# EAGLE board untitled (EAGLE 9.6.2)
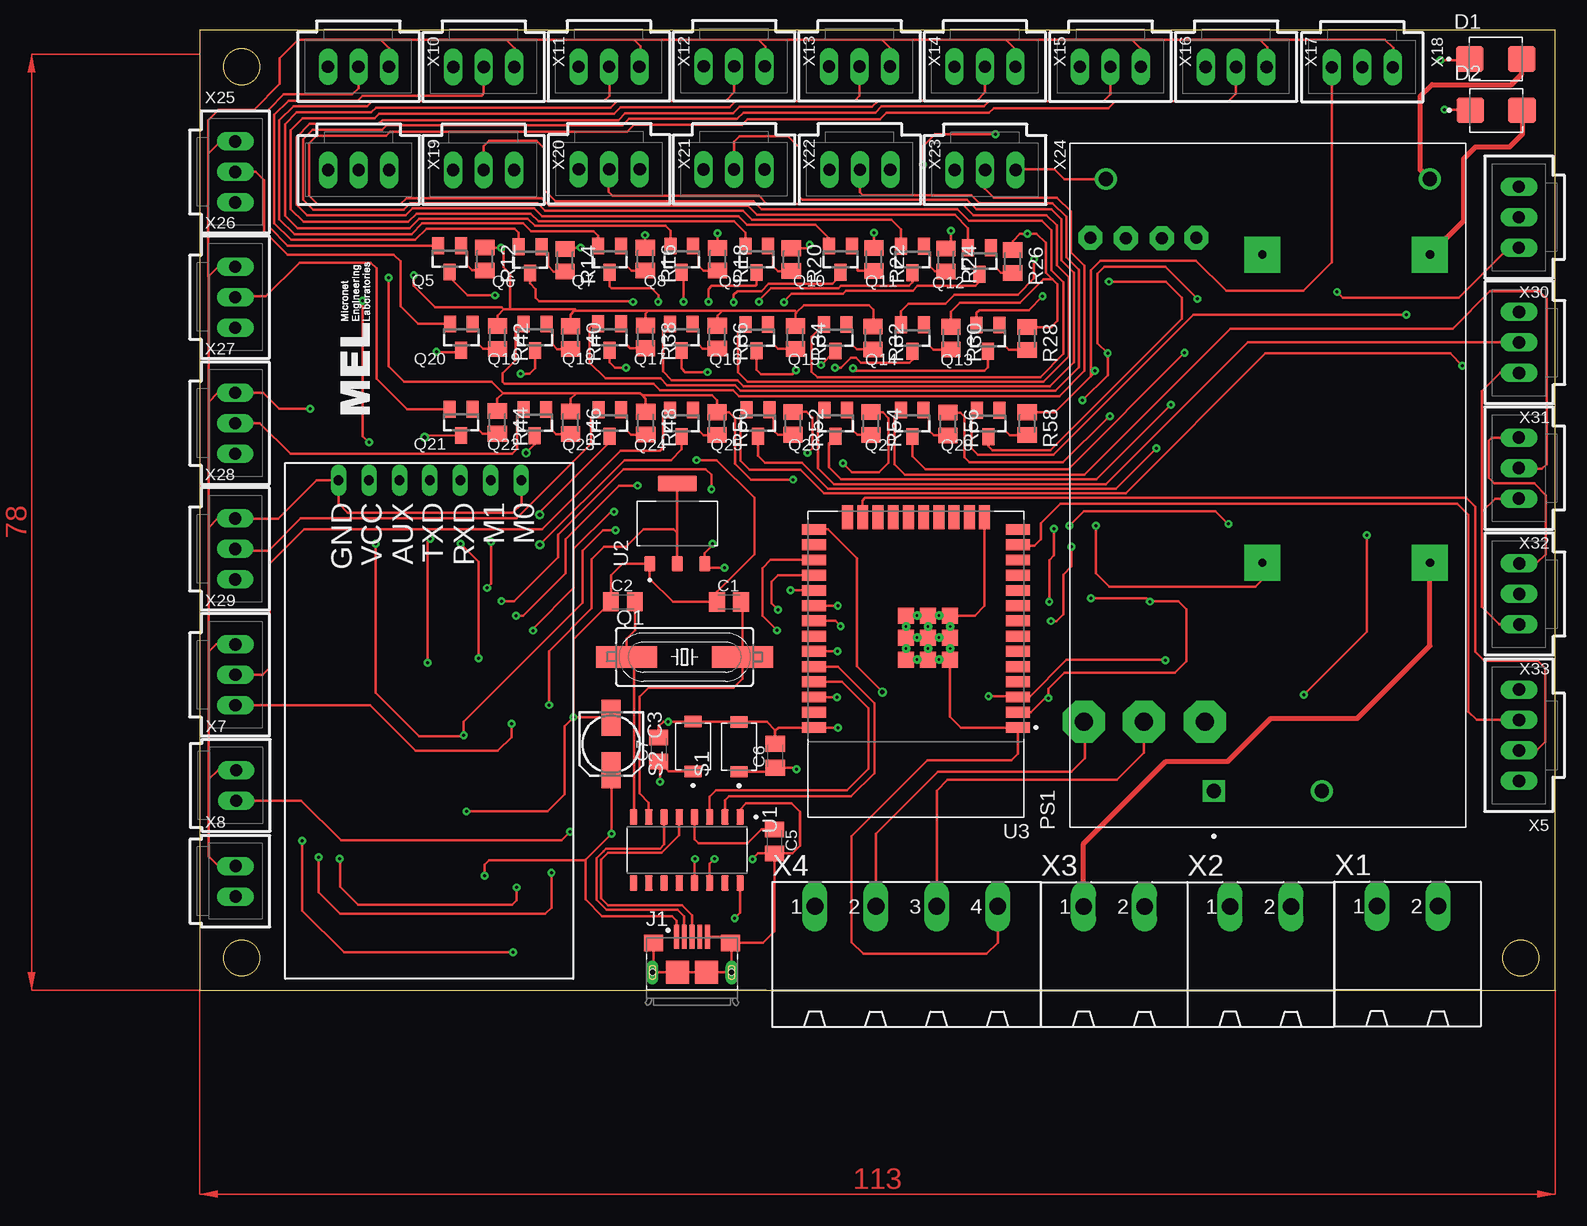
[diagram p2: board, top side]
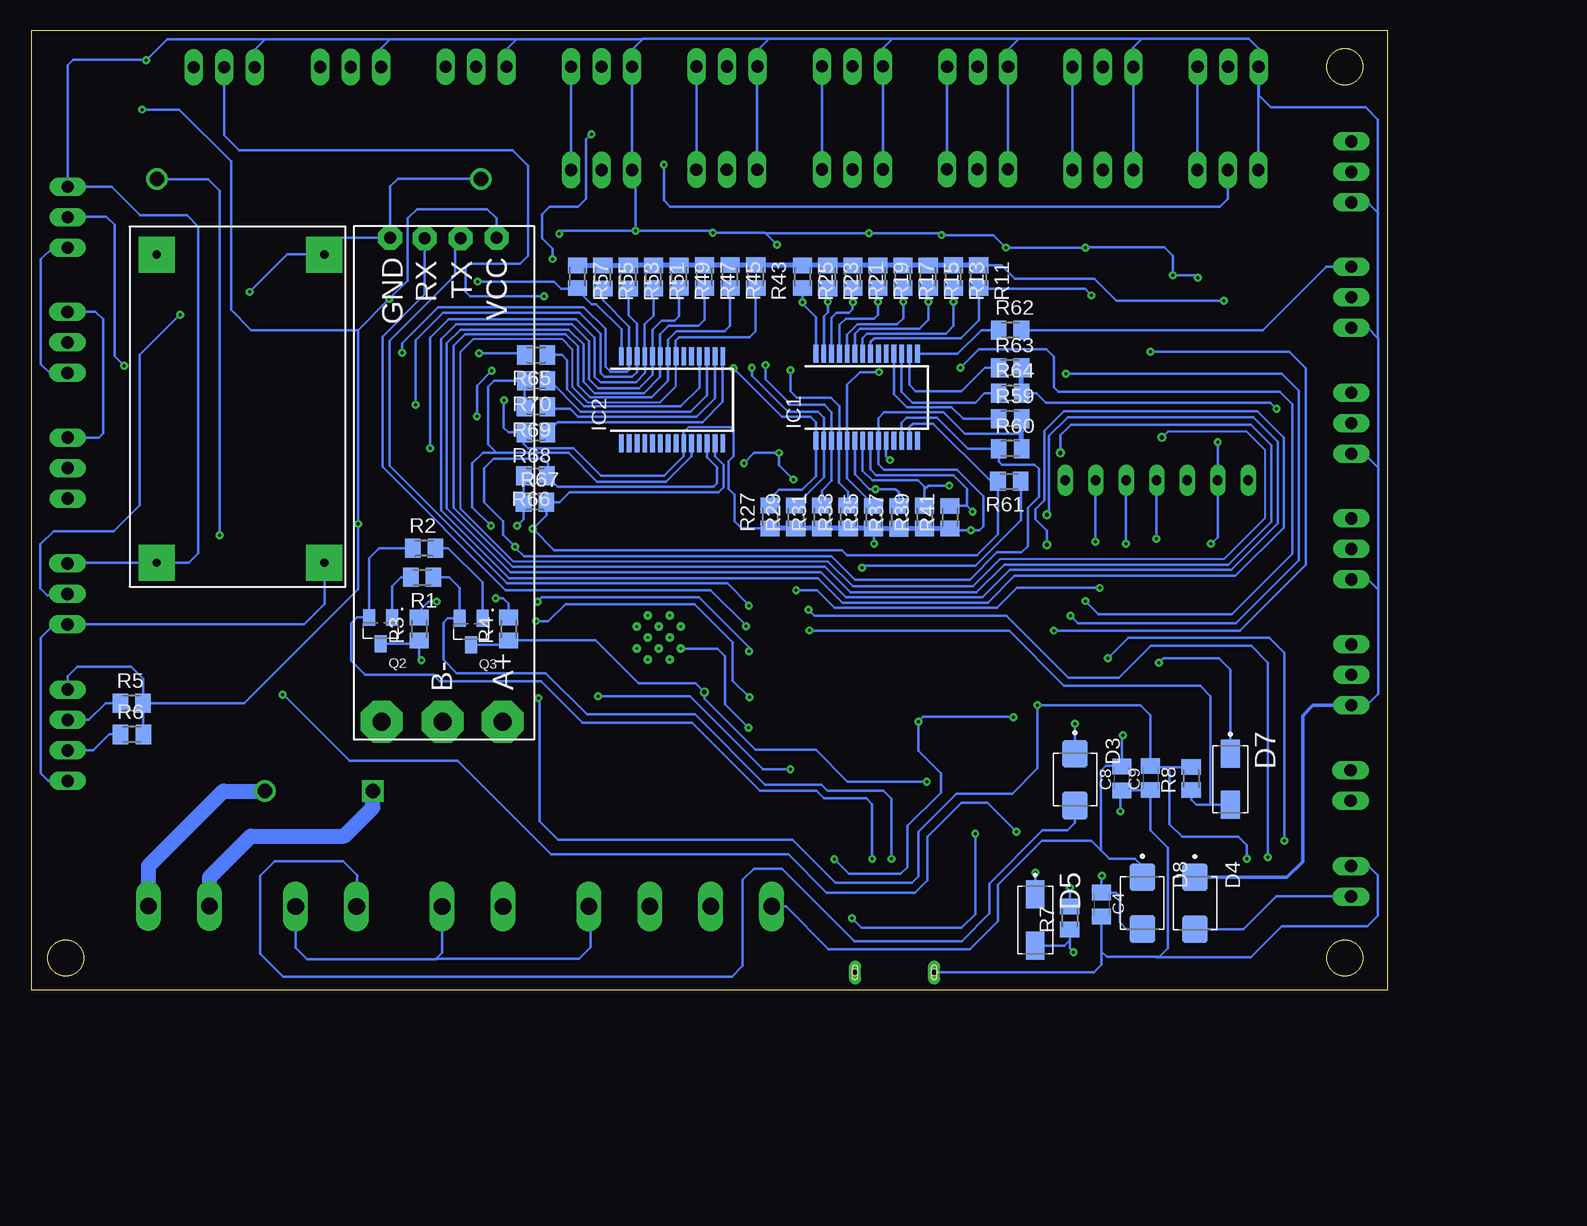
[diagram p3: board, bottom side, seen from below]

Size 113 x 80 mm. Coordinates in mm from the lower left corner, seen from the top.
Outline: 0,0 113,0 113,80 0,80 0,0
Outline: circle at 110.14,2.67 radius 1.5
Outline: circle at 3.52,2.67 radius 1.5
Outline: circle at 3.52,76.95 radius 1.5
Copper layers (1*16): Top 0.035mm / dielectric 1.5mm / Bottom 0.035mm
Design rules "default *": minimum track width 6mil, minimum drill 0.25mm, track to track 6mil, track to pad 6mil, pad to pad 6mil, via to via 6mil, smd to smd 6mil, copper to edge 40mil, drill to drill 6mil, minimum pad ring 10mil, minimum via ring 8mil, stop-mask expansion 4mil, vias tented up to drill 0mil, thermal gap 10mil

## Footprints (pad centres in the part's own frame; a part is rotated, then mirrored left to right if it is on the bottom)
C0805K = smd 1.3 x 1.6: 1 -1,0; 2 1,0
153CLV-0505 = smd 3 x 1.6: + 2.2,0; - -2.2,0
DIOM5336X265N = smd 2.29 x 2.12: A 2.16,0; C -2.16,0
DIOM5226X240N = smd 2.33 x 1.55: A 2.135,0; C -2.135,0
EBYTEE220-900T22D = drill 0.8 pad 1.27 long: AUX -4.56,-10.98; GND -4.56,-16.06; M0 -4.56,-0.82; M1 -4.56,-3.36; RXD -4.56,-5.9; TXD -4.56,-8.44; VCC -4.56,-13.52
SSOP28 = smd 0.4 x 1.5: 1 -4.225,-3.625; 2 -3.575,-3.625; 3 -2.925,-3.625; 4 -2.275,-3.625; 5 -1.625,-3.625; 6 -0.975,-3.625; 7 -0.325,-3.625; 8 0.325,-3.625; 9 0.975,-3.625; 10 1.625,-3.625; 11 2.275,-3.625; 12 2.925,-3.625; 13 3.575,-3.625; 14 4.225,-3.625; 15 4.225,3.625; 16 3.575,3.625; 17 2.925,3.625; 18 2.275,3.625; 19 1.625,3.625; 20 0.975,3.625; 21 0.325,3.625; 22 -0.325,3.625; 23 -0.975,3.625; 24 -1.625,3.625; 25 -2.275,3.625; 26 -2.925,3.625; 27 -3.575,3.625; 28 -4.225,3.625
FCI_10118193-0001LF = smd 0.4 x 2: 1 -1.3,2.975; 2 -0.65,2.975; 3 0,2.975; 4 0.65,2.975; 5 1.3,2.975 | smd 1.6 x 1.4: S1 -3.2,2.45; S2 3.2,2.45 | smd 1.9 x 1.9: S3 1.2,0; S4 -1.2,0 | drill 0.5 pad 0.9 long: S5 -3.3,0; S6 3.3,0 | hole 0.5: -3.3,0; 3.3,0
MINI560 = drill 0.7 pad 3 square: IN+ 0,-1.27; IN- 0,-15.24; OUT+ 25.67,-1.27; OUT- 25.67,-15.24
CONV_HLK-20M12 = drill 1.2 square: 1 -25.5,4.5 | drill 1.2: 2 -25.5,-4.5; 3 25.5,13.5; 4 25.5,-13.5
SM49 = smd 5.08 x 1.778: 1 -4.826,0; 2 4.826,0
SOT95P240X120-3N = smd 1 x 1.4: 1 -0.95,-1.1; 2 0.95,-1.1; 3 0,1.1
SOT23-BEC = smd 1 x 1.4: B -0.95,-1.1; C 0,1.1; E 0.95,-1.1
M0805 = smd 1.3 x 1.6: 1 -0.95,0; 2 0.95,0
SW_TL1015AF160QG = smd 0.95 x 1.4: 1 -2.075,0; 2 2.075,0
TTL-RS485 = drill 1.5 pad 3.5 octagon: A -19.7,-6; B -19.7,-1; P$7 -19.7,4.1 | drill 1 pad 2 octagon: GND 20.6,3.37; RX 20.581,0.505; TX 20.583,-2.493; VCC 20.6,-5.47
SOIC127P600X180-16N = smd 1.31 x 0.62: 1 -2.75,4.445; 2 -2.75,3.175; 3 -2.75,1.905; 4 -2.75,0.635; 5 -2.75,-0.635; 6 -2.75,-1.905; 7 -2.75,-3.175; 8 -2.75,-4.445; 9 2.75,-4.445; 10 2.75,-3.175; 11 2.75,-1.905; 12 2.75,-0.635; 13 2.75,0.635; 14 2.75,1.905; 15 2.75,3.175; 16 2.75,4.445
SOT229P700X180-4N = smd 1.31 x 0.93: 1 -3.345,2.29; 2 -3.345,0; 3 -3.345,-2.29 | smd 1.31 x 3.24: 4 3.345,0
MODULE_ESP32-WROOM-32D = smd 2 x 0.9: 1 -8.5,5.26; 2 -8.5,3.99; 3 -8.5,2.72; 4 -8.5,1.45; 5 -8.5,0.18; 6 -8.5,-1.09; 7 -8.5,-2.36; 8 -8.5,-3.63; 9 -8.5,-4.9; 10 -8.5,-6.17; 11 -8.5,-7.44; 12 -8.5,-8.71; 13 -8.5,-9.98; 14 -8.5,-11.25; 25 8.5,-11.25; 26 8.5,-9.98; 27 8.5,-8.71; 28 8.5,-7.44; 29 8.5,-6.17; 30 8.5,-4.9; 31 8.5,-3.63; 32 8.5,-2.36; 33 8.5,-1.09; 34 8.5,0.18; 35 8.5,1.45; 36 8.5,2.72; 37 8.5,3.99; 38 8.5,5.26 | smd 0.9 x 2: 15 -5.715,-12.25; 16 -4.445,-12.25; 17 -3.175,-12.25; 18 -1.905,-12.25; 19 -0.635,-12.25; 20 0.635,-12.25; 21 1.905,-12.25; 22 3.175,-12.25; 23 4.445,-12.25; 24 5.715,-12.25 | smd 1.33 x 1.33: 39_1 -2.835,-0.405; 39_2 -1,-0.405; 39_3 0.835,-0.405; 39_4 -2.835,-2.24; 39_5 -1,-2.24; 39_6 0.835,-2.24; 39_7 -2.835,-4.075; 39_8 -1,-4.075; 39_9 0.835,-4.075 | drill 0.2 pad 0.3: 39_10 -1.917,-0.405; 39_11 -0.083,-0.405; 39_12 -2.835,-1.323; 39_13 -1,-1.323; 39_14 0.835,-1.323; 39_15 -1.917,-2.24; 39_16 -0.083,-2.24; 39_17 -2.835,-3.158; 39_18 -1,-3.158; 39_19 0.835,-3.158; 39_20 -1.917,-4.075; 39_21 -0.083,-4.075
MSTBA2 = drill 1.397 long: 1 -2.54,5.08; 2 2.54,5.08
MSTBA4 = drill 1.397 long: 1 -7.62,5.08; 2 -2.54,5.08; 3 2.54,5.08; 4 7.62,5.08
70543-04 = drill 1.016 long: 1 -3.81,0; 2 -1.27,0; 3 1.27,0; 4 3.81,0
70543-02 = drill 1.016 long: 1 -1.27,0; 2 1.27,0
70543-03 = drill 1.016 long: 1 -2.54,0; 2 0,0; 3 2.54,0

## Placement (x,y rotation side)
C1  22pF  [C0805K]  44.14,32.33 0 top
C2  22pF  [C0805K]  35.29,32.34 0 top
C3  10uF/16V  [153CLV-0505]  34.31,20.5 270 top
C4  1uF  [C0805K]  23.81,7.11 270 bottom
C5  100nF  [C0805K]  47.93,12.39 270 top
C6  100nF  [C0805K]  47.99,19.52 90 top
C7  100nF  [C0805K]  38.27,20.04 90 top
C8  1uF  [C0805K]  22.11,17.63 90 bottom
C9  1uF  [C0805K]  19.72,17.66 90 bottom
D1  SS24  [DIOM5336X265N]  108.05,77.58 0 top
D2  SS24  [DIOM5336X265N]  108.09,73.31 0 top
D3  SS24  [DIOM5336X265N]  26.02,17.54 270 bottom
D4  SS24  [DIOM5336X265N]  16.02,7.22 270 bottom
D5  US1M-13  [DIOM5226X240N]  29.33,5.83 270 bottom
D7  US1M-13  [DIOM5226X240N]  13.07,17.56 270 bottom
D8  SS24  [DIOM5336X265N]  20.41,7.25 270 bottom
EBYTEE220-900T22D1  [EBYTEE220-900T22D]  27.64,37.92 270 top
IC1  MCP23017SS  [SSOP28]  43.39,49.38 0 bottom
IC2  MCP23017SS  [SSOP28]  59.61,49.19 0 bottom
J1  10118193-0001LF  [FCI_10118193-0001LF]  41.06,1.47 0 top
MINI1  [MINI560]  103.84,35.61 90 bottom
PS1  HLK-20M12  [CONV_HLK-20M12]  89.06,42.07 90 top
Q1  12MHz  [SM49]  40.43,27.76 0 top
Q2  MMBT3904  [SOT95P240X120-3N]  83.91,29.95 180 bottom
Q3  MMBT3904  [SOT95P240X120-3N]  76.37,29.88 180 bottom
Q5  MMBT2222  [SOT23-BEC]  20.86,60.93 180 top
Q6  MMBT2222  [SOT23-BEC]  27.55,60.85 180 top
Q7  MMBT2222  [SOT23-BEC]  34.19,60.91 180 top
Q8  MMBT2222  [SOT23-BEC]  40.2,60.91 180 top
Q9  MMBT2222  [SOT23-BEC]  46.45,60.89 180 top
Q10  MMBT2222  [SOT23-BEC]  53.43,60.9 180 top
Q11  MMBT2222  [SOT23-BEC]  59.44,60.88 180 top
Q12  MMBT2222  [SOT23-BEC]  65.02,60.75 180 top
Q13  MMBT2222  [SOT23-BEC]  65.73,54.32 180 top
Q14  MMBT2222  [SOT23-BEC]  59.44,54.34 180 top
Q15  MMBT2222  [SOT23-BEC]  53,54.35 180 top
Q16  MMBT2222  [SOT23-BEC]  46.45,54.37 180 top
Q17  MMBT2222  [SOT23-BEC]  40.17,54.4 180 top
Q18  MMBT2222  [SOT23-BEC]  34.18,54.41 180 top
Q19  MMBT2222  [SOT23-BEC]  27.98,54.4 180 top
Q20  MMBT2222  [SOT23-BEC]  21.83,54.4 180 top
Q21  MMBT2222  [SOT23-BEC]  21.81,47.31 180 top
Q22  MMBT2222  [SOT23-BEC]  27.95,47.28 180 top
Q23  MMBT2222  [SOT23-BEC]  34.2,47.25 180 top
Q24  MMBT2222  [SOT23-BEC]  40.18,47.23 180 top
Q25  MMBT2222  [SOT23-BEC]  46.55,47.24 180 top
Q26  MMBT2222  [SOT23-BEC]  53.03,47.23 180 top
Q27  MMBT2222  [SOT23-BEC]  59.42,47.23 180 top
Q28  MMBT2222  [SOT23-BEC]  65.75,47.21 180 top
R1  10k  [M0805]  80.44,34.39 180 bottom
R2  10k  [M0805]  80.27,36.81 0 bottom
R3  10k  [M0805]  80.69,30.09 90 bottom
R4  10k  [M0805]  73.23,30.09 90 bottom
R5  680  [M0805]  104.65,23.89 0 bottom
R6  680  [M0805]  104.64,21.3 0 bottom
R7  10k  [M0805]  26.46,6 90 bottom
R8  10k  [M0805]  16.33,17.62 90 bottom
R11  1k  [M0805]  34.04,59.45 270 bottom
R12  30k  [M0805]  23.79,60.91 270 top
R13  1k  [M0805]  36.15,59.45 270 bottom
R14  30k  [M0805]  30.47,60.81 270 top
R15  1k  [M0805]  38.25,59.44 270 bottom
R16  30k  [M0805]  37.17,60.91 270 top
R17  1k  [M0805]  40.35,59.44 270 bottom
R18  30k  [M0805]  43.19,60.9 270 top
R19  1k  [M0805]  42.44,59.44 270 bottom
R20  30k  [M0805]  49.32,60.86 270 top
R21  1k  [M0805]  44.54,59.44 270 bottom
R22  30k  [M0805]  56.22,60.87 270 top
R23  1k  [M0805]  46.63,59.43 270 bottom
R24  30k  [M0805]  62.23,60.84 270 top
R25  1k  [M0805]  48.72,59.44 270 bottom
R26  30k  [M0805]  67.79,60.7 270 top
R27  1k  [M0805]  51.43,39.42 90 bottom
R28  30k  [M0805]  68.99,54.29 270 top
R29  1k  [M0805]  49.29,39.41 90 bottom
R30  30k  [M0805]  62.65,54.32 270 top
R31  1k  [M0805]  47.13,39.41 90 bottom
R32  30k  [M0805]  56.14,54.34 270 top
R33  1k  [M0805]  44.93,39.41 90 bottom
R34  30k  [M0805]  49.67,54.37 270 top
R35  1k  [M0805]  42.81,39.39 90 bottom
R36  30k  [M0805]  43.17,54.4 270 top
R37  1k  [M0805]  40.69,39.39 90 bottom
R38  30k  [M0805]  37.18,54.43 270 top
R39  1k  [M0805]  38.56,39.41 90 bottom
R40  30k  [M0805]  30.93,54.36 270 top
R41  1k  [M0805]  36.45,39.4 90 bottom
R42  30k  [M0805]  24.85,54.37 270 top
R43  1k  [M0805]  52.63,59.46 270 bottom
R44  30k  [M0805]  24.83,47.3 270 top
R45  1k  [M0805]  54.77,59.46 270 bottom
R46  30k  [M0805]  30.93,47.27 270 top
R47  1k  [M0805]  56.9,59.45 270 bottom
R48  30k  [M0805]  37.2,47.24 270 top
R49  1k  [M0805]  59.03,59.44 270 bottom
R50  30k  [M0805]  43.14,47.2 270 top
R51  1k  [M0805]  61.14,59.43 270 bottom
R52  30k  [M0805]  49.47,47.22 270 top
R53  1k  [M0805]  63.25,59.42 270 bottom
R54  30k  [M0805]  55.98,47.21 270 top
R55  1k  [M0805]  65.38,59.42 270 bottom
R56  30k  [M0805]  62.4,47.17 270 top
R57  1k  [M0805]  67.49,59.44 270 bottom
R58  30k  [M0805]  69,47.19 270 top
R59  10k  [M0805]  31.42,47.61 0 bottom
R60  10k  [M0805]  31.42,45.12 0 bottom
R61  10k  [M0805]  31.49,42.39 180 bottom
R62  10k  [M0805]  31.43,54.99 0 bottom
R63  10k  [M0805]  31.44,51.85 0 bottom
R64  10k  [M0805]  31.42,49.73 0 bottom
R65  10k  [M0805]  70.94,52.92 180 bottom
R66  10k  [M0805]  71,42.85 180 bottom
R67  10k  [M0805]  71.03,40.64 0 bottom
R68  10k  [M0805]  70.96,46.46 180 bottom
R69  10k  [M0805]  70.95,48.62 180 bottom
R70  10k  [M0805]  70.95,50.77 180 bottom
S1  TL1015AF160QG  [SW_TL1015AF160QG]  44.98,20.26 90 top
S2  TL1015AF160QG  [SW_TL1015AF160QG]  41.14,20.29 90 top
TTL-RS1  [TTL-RS485]  79.72,42.07 90 bottom
U1  CH340G  [SOIC127P600X180-16N]  40.63,11.66 270 top
U2  AMS1117  [SOT229P700X180-4N]  39.82,38.87 90 top
U3  ESP32-WROOM-32D  [MODULE_ESP32-WROOM-32D]  59.73,27.13 180 top
X1  MSTBA2  [MSTBA2]  100.71,1.92 0 top
X2  MSTBA2  [MSTBA2]  88.45,1.88 0 top
X3  MSTBA2  [MSTBA2]  76.24,1.89 0 top
X4  MSTBA4  [MSTBA4]  58.92,1.89 0 top
X5  C-GRID-04-70543  [70543-04]  109.99,21.23 90 top
X7  C-GRID-02-70543  [70543-02]  3.05,17.05 270 top
X8  C-GRID-02-70543  [70543-02]  3,9.06 270 top
X10  C-GRID-03-70543  [70543-03]  13.25,76.93 180 top
X11  C-GRID-03-70543  [70543-03]  23.7,76.92 180 top
X12  C-GRID-03-70543  [70543-03]  34.13,76.95 180 top
X13  C-GRID-03-70543  [70543-03]  44.57,76.97 180 top
X14  C-GRID-03-70543  [70543-03]  55.02,76.96 180 top
X15  C-GRID-03-70543  [70543-03]  65.47,76.95 180 top
X16  C-GRID-03-70543  [70543-03]  75.94,76.93 180 top
X17  C-GRID-03-70543  [70543-03]  86.41,76.92 180 top
X18  C-GRID-03-70543  [70543-03]  96.93,76.9 180 top
X19  C-GRID-03-70543  [70543-03]  13.27,68.34 180 top
X20  C-GRID-03-70543  [70543-03]  23.68,68.33 180 top
X21  C-GRID-03-70543  [70543-03]  34.16,68.4 180 top
X22  C-GRID-03-70543  [70543-03]  44.57,68.38 180 top
X23  C-GRID-03-70543  [70543-03]  55.05,68.36 180 top
X24  C-GRID-03-70543  [70543-03]  65.49,68.33 180 top
X25  C-GRID-03-70543  [70543-03]  2.98,68.17 270 top
X26  C-GRID-03-70543  [70543-03]  2.99,57.73 270 top
X27  C-GRID-03-70543  [70543-03]  2.98,47.23 270 top
X28  C-GRID-03-70543  [70543-03]  2.98,36.76 270 top
X29  C-GRID-03-70543  [70543-03]  2.99,26.26 270 top
X30  C-GRID-03-70543  [70543-03]  109.98,64.4 90 top
X31  C-GRID-03-70543  [70543-03]  110,53.96 90 top
X32  C-GRID-03-70543  [70543-03]  109.98,43.5 90 top
X33  C-GRID-03-70543  [70543-03]  110.01,33 90 top

## Tracks (layer width: path | path; a pad name or v marks a point on that pad's centre or on a via)
5V+
  Top 0.406: MINI1.OUT+ 105.38,64.09 105.38,69.27 106.37,70.26 109.21,70.26 110.29,71.35 110.29,73.27 D2.A
5V++  (via drill 0.25)
  Top 0.203: U2.3 42.11,35.56 | 42.11,35.56 42.11,36.39 42.77,37.05 42.77,37.18 v42.76,37.19 | v22.03,21.23 22.03,21.38 | 22.03,21.38 22.03,22.36 31.95,32.27 31.95,36.62 33.66,38.33 v34.69,38.33 | v83.17,57.58 83.18,57.59 83.18,57.61 80.52,60.28 75.44,60.28 74.85,59.68 74.85,53.91 v75.7,53.06 75.7,51.23 v73.61,49.13 | v14.69,37.17 14.69,24.77 18.3,21.16 21.81,21.16 22.03,21.38 | v43.78,35.17 42.5,35.17 42.11,35.56 | v13.61,57.45 13.61,46.16 v14.13,45.63 | v103.78,73.37 105.87,73.37 D2.C | v72.51,38.68 73.73,39.9 84.66,39.9 85.76,38.8 85.78,38.82 v85.78,38.84
  Bottom 0.203: 20.38,9.38 D8.C 20.41,10.33 21.01,10.94 23.14,10.94 23.85,11.65 | 30.52,42.38 R61.1 30.54,39.14 34.32,35.36 43.59,35.36 v43.78,35.17 | X4.1 50.12,6.97 46.57,3.41 34.77,3.41 32.45,5.74 32.45,8.77 28.76,12.45 24.66,12.45 23.85,11.65 | 71.89,53.62 R65.2 72.03,53.06 v75.7,53.06 | 67.5,60.4 67.48,60.37 | 23.85,11.65 23.85,18.28 23.45,18.68 22.16,18.68 C8.2 22.11,21.15 v22.03,21.23 | v42.76,37.19 42.76,38.44 42.75,38.44 | 30.47,46.59 30.71,46.35 35.2,46.35 37,48.15 41.92,48.15 42.41,47.66 IC1.9 42.41,43.82 41.93,43.34 35.85,43.34 33.66,41.14 33.66,38.65 33.97,38.33 v34.69,38.33 36.43,38.33 36.55,38.45 | R5.2 103.69,23.87 R6.2 | X5.4 109.99,26.15 109.19,26.95 104.7,26.95 103.7,25.95 R5.2 | v22.03,21.23 | R66.2 71.98,42.81 R67.1 71.98,39.21 v72.51,38.68 | R5.2 95.29,23.89 85.78,33.4 v85.78,38.84 85.78,54.97 | 85.78,54.97 v83.17,57.58 81.66,59.1 81.66,64.29 80.88,65.07 75.02,65.07 74.25,64.3 TTL-RS1.VCC | R27.1 53.8,38.47 54.41,39.08 54.41,41.28 54.88,41.76 54.88,44.05 54.46,44.47 54.46,46.64 54.71,46.89 58.25,46.89 58.66,46.47 58.66,45.58 IC2.9 58.64,44.49 60.28,42.85 65.52,42.85 67.83,45.16 71.6,45.16 71.97,45.53 71.97,46.41 R68.2 73.24,46.46 73.64,46.86 73.64,49.1 v73.61,49.13 | v14.69,37.17 14.12,37.74 EBYTEE220-900T22D1.VCC v14.13,45.63 | R11.1 32.16,60.4 31.04,59.28 24.41,59.28 22.58,57.45 v13.61,57.45 | 85.78,54.97 94.68,54.97 96.38,56.67 96.38,69.07 100.69,73.37 v103.78,73.37
  Bottom 0.406: R41.1 36.55,38.45 38.55,38.45 R39.1 40.67,38.46 R37.1 42.75,38.44 R35.1 42.82,38.46 R33.1 R31.1 R29.1 R27.1 | 30.52,45.07 R60.2 30.47,46.59 R59.2 | R59.2 | R11.1 R13.1 38.24,60.4 R15.1 R17.1 | R17.1 | R17.1 R19.1 | R19.1 | R19.1 R21.1 | R21.1 | R21.1 R23.1 R25.1 48.74,60.41 R43.1 R45.1 R47.1 R49.1 R51.1 63.24,60.38 R53.1 R55.1 67.48,60.37 R57.1 67.51,60.41
12V  (via drill 0.25)
  Top 0.203: X7.2 8.49,15.77 11.79,12.47 30.19,12.47 v30.9,13.18 | v92.06,24.61 97.32,29.87 v97.32,37.88
  Top 0.406: PS1.4 101.74,68.39 101.74,74.46 102.73,75.45 109.36,75.45 110.21,76.3 D1.A
  Bottom 0.203: v30.9,13.18 33.33,15.61 35.48,15.61 38.3,12.78 38.3,9.14 39.34,8.1 46.72,8.1 49.92,11.29 69.69,11.29 77.48,19.09 86.48,19.09 92,24.61 v92.06,24.61 | v97.32,37.88 97.31,37.89 97.31,66.6 98.28,67.57 PS1.4
12V+  (via drill 0.25)
  Top 0.203: v103.44,77.48 105.79,77.48 D1.C | X33.3 111.45,35.54 112.23,36.32 112.23,41.25 111.27,42.21 107.93,42.21 107.46,42.68 107.46,45.77 107.73,46.03 X32.3 | v26.02,22.2 26.02,21.08 24.87,19.92 18.01,19.92 14.21,23.72 X29.3 | R26.1 67.79,62.41 68.39,63.01 v69.01,63.01 69.78,63.01 70.54,62.25 70.54,59.79 71.09,59.23 | v62.65,63.27 62.65,62.21 R24.1 | R22.1 56.22,62.99 56.21,63 v56.21,63.11 | R20.1 50.59,61.81 v50.87,62.09 | v50.87,62.09 | R18.1 43.19,62.97 43.18,62.99 v43.18,63.05 | R16.1 37.13,61.89 v37.13,62.92 | R14.1 30.59,61.87 v31.76,61.87 | R12.1 v25.14,61.86 25.34,61.66 25.34,60.23 25.9,59.67 25.9,56.71 | R28.1 71,55.24 71.52,55.75 71.52,58.81 71.09,59.23 | R30.1 62.65,56.54 63.4,57.29 68.41,57.29 70.36,59.23 71.09,59.23 | R34.1 49.67,56.36 49.78,56.47 | 49.78,56.47 50.37,57.06 55.79,57.06 56.17,56.69 56.17,55.31 R32.1 | R36.1 43.17,56.18 43.59,56.6 | 43.59,56.6 49.65,56.6 49.78,56.47 | R38.1 37.17,56.36 37.41,56.6 | 37.41,56.6 43.59,56.6 | R40.1 30.93,56.29 31.24,56.6 | 31.24,56.6 37.41,56.6 | 31.24,56.6 31.33,56.69 31.3,56.71 25.9,56.71 | R42.1 24.85,56.2 25.37,56.71 | 25.37,56.71 25.9,56.71 | R48.1 37.2,49.29 36.92,49.57 | 31.42,49.75 36.74,49.75 36.92,49.57 | R46.1 30.93,49.25 31.42,49.75 | 31.42,49.75 25.29,49.75 | R44.1 24.83,49.28 25.29,49.75 | v49.49,42.54 45.96,42.54 44.63,43.87 44.63,47.66 44.15,48.15 R50.1 43.14,49.17 42.73,49.57 36.92,49.57 | R52.1 50.59,48.17 51.08,47.68 51.08,45.16 v50.68,44.75 | R54.1 56.95,48.16 57.45,47.66 57.45,43.96 56.64,43.14 54.4,43.14 v53.63,43.91 | R56.1 63.42,48.12 63.78,47.76 63.78,44.38 64.19,43.96 71.99,43.96 75.65,47.62 75.65,47.59 v75.88,47.82
  Top 0.203: R58.1 71.31,48.14 74.31,51.15 | 74.31,51.15 74.61,51.45 74.61,51.58 v74.63,51.6 | 74.31,51.15 74.31,60 75.09,60.77 83.07,60.77 85.58,58.26 92.01,58.26 94.39,60.64 X18.3 | 25.37,56.71 25.2,56.88 19.66,56.88 17.87,58.68 v17.87,59.56 | 25.29,49.75 24.36,50.67 17.06,50.67 15.76,51.97 v15.76,59.36
  Top 0.406: X3.1 73.7,12.19 80.56,19.06 85.72,19.06 89.3,22.63 96.53,22.63 102.57,28.68 MINI1.IN+
  Bottom 0.203: X33.3 109.94,35.61 MINI1.IN+ 99.9,35.61 99.1,36.4 99.1,63.61 100.04,64.56 103.95,64.56 106.34,66.94 X30.3 109.98,77.08 109.54,77.52 103.48,77.52 v103.44,77.48 v103.43,77.48 101.7,79.22 93.54,79.22 | X29.3 1.69,23.72 0.73,24.67 0.73,33.34 | X28.3 1.61,34.22 0.73,33.34 | 0.73,33.34 0.72,33.33 0.72,43.51 0.75,43.54 | X27.3 1.9,44.69 0.75,43.54 | 0.75,43.54 0.75,54.32 0.76,54.33 | X26.3 1.62,55.19 0.76,54.33 | 0.76,54.33 0.76,64.72 | 0.75,64.72 0.76,64.72 | 0.76,64.72 0.79,64.76 | X25.3 1.67,65.64 0.79,64.76 | 10.7,76.95 X10.3 | X10.3 10.71,78.43 11.53,79.26 20.46,79.26 | 20.46,79.26 20.43,79.29 30.68,79.29 | 20.46,79.26 21.2,78.51 21.2,76.97 X11.3 21.15,76.91 X20.3 | 30.68,79.29 31.59,78.38 X12.3 31.62,76.92 X21.3 | 30.68,79.29 | 30.68,79.29 41.23,79.29 41.24,79.28 | 41.24,79.28 42.03,78.49 X13.3 X22.3 | 41.24,79.28 51.53,79.28 51.53,79.27 | 51.53,79.27 52.48,78.32 X14.3 52.51,76.94 X23.3 | 51.53,79.27 62.05,79.27 62.07,79.25 | 62.07,79.25 62.95,78.36 62.95,76.96 X15.3 62.95,76.93 X24.3 62.65,68.03 v62.65,63.27 | 62.07,79.25 72.54,79.25 72.57,79.22 | 72.57,79.22 73.44,78.35 73.44,76.97 X16.3 | 72.57,79.22 83.11,79.22 | 83.11,79.22 83.9,78.42 83.9,76.95 X17.3 | 83.11,79.22 93.54,79.22 | X18.3 94.39,78.36 93.54,79.22 | X19.3 10.73,76.91 X10.3 | X32.3 107.4,46.03 107.04,46.4 107.04,55.89 107.68,56.53 109.97,56.53 X31.3 | D3.C v26.02,22.19 v26.02,22.2 | v69.01,63.01 68.75,63.27 v62.65,63.27 | v62.65,63.27 56.37,63.27 v56.21,63.11 51.89,63.11 51.83,63.05 | v50.87,62.09 51.83,63.05 | 51.83,63.05 v43.18,63.05 37.27,63.05 v37.13,62.92 32.81,62.92 v31.76,61.87 31.75,61.86 25.27,61.86 | v25.14,61.86 25.27,61.86
  Bottom 0.203: v49.49,42.54 50.69,43.73 v50.69,44.74 v50.68,44.75 52.78,44.75 v53.63,43.91 | v75.88,47.82 75.88,50.35 v74.63,51.6 | 25.27,61.86 25.23,61.9 18.58,61.9 17.87,61.18 v17.87,59.56 15.97,59.56 v15.76,59.36 | X10.3 10.71,74.58 9.67,73.55 1.77,73.55 0.77,72.54 0.77,64.76 0.79,64.76
  Bottom 0.305: D4.C 8.35,9.38 7.05,10.69 7.05,22.88 6.18,23.74 3.01,23.74 X29.3
A+
  Top 0.203: X4.2 56.38,13 61.58,18.2 72.69,18.2 73.8,19.32 73.8,22.29 TTL-RS1.A
B-
  Top 0.203: X4.3 61.46,16.61 62.36,17.51 76.46,17.51 78.72,19.78 TTL-RS1.B
DTR  (via drill 0.25)
  Top 0.203: U1.13 41.26,10.9 41.3,10.93 v41.31,10.92
  Bottom 0.203: R1.1 78.17,34.39 77.32,33.54 Q3.2 78.3,30.98 78.66,30.61 78.66,27.51 77.56,26.41 70.16,26.41 66.71,22.96 57.69,22.96 51.84,17.12 47.13,17.12 46.63,16.61 41.98,16.61 41.31,15.95 v41.31,10.92
EN  (via drill 0.25)
  Top 0.203: S1.1 47.66,18.19 C6.1 49.62,18.52 v49.75,18.39 | v65.78,24.47 68.16,24.47 U3.3 | U3.3 | U3.3 69.19,24.41 72.28,27.51 80.48,27.51 v80.5,27.48
  Bottom 0.203: Q2.3 80.98,28.85 R3.1 80.69,27.66 v80.5,27.48 | v49.75,18.39 52.04,18.39 58.12,24.47 v65.78,24.47
GND  (via drill 0.25)
  Top 0.203: X8.1 1.6,10.33 0.79,11.15 0.79,17.55 | X7.1 1.55,18.31 0.79,17.55 | 0.79,17.55 | 0.79,17.55 0.79,28.16 0.75,28.2 | 0.75,28.2 1.38,28.82 2.97,28.82 X29.1 | 0.75,28.2 0.75,38.52 | 2.65,39.3 1.53,39.3 0.75,38.52 | 2.65,39.3 X28.1 | 0.75,38.52 0.75,48.99 | 0.75,48.99 1.54,49.77 X27.1 5.29,49.77 6.62,48.44 v9.21,48.44 | 60.67,31.2 U3.39_21 U3.39_9 U3.39_19 58.89,29.41 | 60.67,31.2 U3.39_8 U3.39_20 62.54,31.2 | 62.54,31.2 U3.39_7 64.64,31.2 65.44,32 U3.15 | 62.54,31.2 62.54,30.31 U3.39_17 U3.39_4 | 60.67,31.2 60.67,30.34 U3.39_18 U3.39_5 | 58.89,29.41 U3.39_6 U3.39_14 U3.39_3 U3.39_11 U3.39_2 | 58.89,29.41 58.94,29.37 U3.39_16 60.65,29.37 | U3.39_5 60.65,29.37 | U3.39_5 U3.39_15 U3.39_4 | U3.39_4 U3.39_12 U3.39_1 | 60.65,29.37 60.65,28.53 U3.39_13 U3.39_2 | U3.39_2 U3.39_10 U3.39_1 | C6.2 47.99,21.59 | 47.99,21.59 47.99,21.66 47.32,22.34 S1.2 44.96,22.36 S2.2 v39.08,22.36 38.67,22.36 38.27,21.97 C7.2 | 47.99,21.59 48.28,21.87 U3.38 51.26,21.84 v53.23,21.84 | 0.75,48.99 0.75,59.49 | X26.1 1.54,60.27 0.75,59.49 | 0.75,59.49 0.74,59.47 0.74,69.69 | X25.1 1.75,70.71 0.74,69.69 | 0.74,69.69 0.72,69.68 0.72,72.48 1.61,73.37 4.55,73.37 6.69,75.51 6.69,77.65 8.21,79.17 | 25.56,79.18 25.56,79.17 | 25.56,79.17 26.26,78.47 26.26,76.95 X11.1 | 36.24,79.17 25.56,79.17 | 36.24,79.17 | 36.24,79.17 36.75,78.67 36.75,77.02 X12.1 | 36.24,79.17 46.62,79.17 | 46.62,79.17 47.17,78.61 47.17,77.02 X13.1 | 46.62,79.17 46.61,79.18 56.91,79.18 | 56.91,79.18 57.65,78.44 57.65,77.04 X14.1 | 56.91,79.18 67.22,79.18 67.22,79.17 | X15.1 68.01,78.39 67.22,79.17 | 67.22,79.17 77.73,79.17 | X16.1 78.48,78.42 77.73,79.17 | 77.73,79.17 77.72,79.19 88.4,79.19
  Top 0.203: 88.4,79.19 88.38,79.21 98.82,79.21 99.5,78.52 99.5,76.92 X18.1 | 88.4,79.19 89.02,78.56 89.02,76.99 X17.1 | EBYTEE220-900T22D1.M0 26.83,42.47 26.83,40.49 26.11,39.77 12.36,39.77 11.58,40.55 EBYTEE220-900T22D1.GND 9.77,42.48 6.56,39.27 2.67,39.27 2.65,39.3 | J1.S2 46.97,3.92 47.93,4.88 C5.2 | C5.2 49.41,11.39 50.04,12.01 50.04,14.86 49.35,15.54 45.56,15.54 45.01,14.99 45.01,14.48 U1.1 | U3.1 68.16,21.87 | 68.16,21.87 63.46,21.87 62.56,22.77 U3.39_1 | X4.4 66.54,3.94 65.61,3.01 55.33,3.01 54.35,3.99 54.35,12.81 60.69,19.15 67.69,19.15 68.21,19.67 68.21,21.82 68.16,21.87 | v41.44,44.17 43.12,44.17 46.28,41.01 46.28,36.33 43.14,33.2 C1.1 39.47,32.33 37.53,34.27 U2.1 35.27,35.52 34.29,34.55 C2.1 31.16,29.22 v31.16,22.74 | X33.1 108.36,30.46 106.87,31.95 106.87,39.83 106.89,39.85 | X32.1 108,40.95 106.89,39.85 | 106.89,39.85 106.89,49.89 108.44,51.43 109.99,51.43 X31.1 | v22.25,14.88 29,14.88 30.42,16.3 30.42,22 v31.16,22.74 | v31.16,22.74 34.27,22.74 C3.- | J1.S2 44.36,3.82 J1.S6 J1.S3 J1.S4 39.77,1.38 39.02,1.38 38.93,1.47 J1.S5 37.86,1.57 J1.S1 | J1.S2 43.73,4.44 J1.5 | C5.2 46.56,11.39 v46.09,10.91 | PS1.3 72.1,67.57 71.28,68.39 68.09,68.39 X24.1 | X30.1 109.16,61.86 104.98,57.69 95.31,57.69 v94.83,58.17 | v74.71,38.7 74.71,34.72 75.83,33.6 88.02,33.6 88.7,34.27 88.7,35.51 MINI1.IN- | 8.21,79.17 8.22,79.17 | 25.56,79.17 15.11,79.17 | 15.11,79.17 8.21,79.17 | 15.11,79.17 15.79,78.49 X10.1
  Bottom 0.203: 88.58,61.3 87.2,62.67 TTL-RS1.GND 83.09,66.96 82.45,67.61 75.6,67.61 PS1.3 | 88.58,61.3 MINI1.OUT- | MINI1.IN- 88.57,35.58 88.57,32.19 90.29,30.46 X33.1 111.09,30.46 112.22,29.34 112.22,18.05 111.59,17.42 X5.1 | X2.2 90.99,3.52 90.02,2.56 79.31,2.56 79.28,2.59 | X3.2 78.78,3.09 79.28,2.59 | 79.28,2.59 67.37,2.59 66.41,3.55 66.41,6.84 X4.4 | X19.1 15.81,76.91 X10.1 | X20.1 26.23,76.91 X11.1 | X21.1 36.7,76.92 X12.1 | X22.1 X13.1 | X23.1 57.59,76.94 X14.1 | X24.1 68.03,76.93 X15.1 | C4.2 23.81,3.19 | 23.81,3.19 23.38,2.75 19.28,2.75 | 19.28,2.75 18.98,2.75 18.27,3.47 18.27,11.86 19.72,13.32 C9.1 22.09,16.66 C8.1 22.25,16.5 v22.25,14.88 | IC1.10 41.76,44.49 v41.44,44.17 | IC2.10 57.99,44.47 60.1,42.36 65.84,42.36 68.24,44.77 74.23,44.77 | 71.98,48.7 R69.2 R70.2 | U3.39_14 55.84,28.45 55.21,27.82 55.21,23.81 v53.23,21.84 | R70.2 | X31.1 111.48,51.42 112.22,52.16 112.22,60.89 111.24,61.86 X30.1 | v31.16,22.74 31.16,22.75 38.69,22.75 v39.08,22.36 39.08,19.93 37.2,18.05 37.2,16.44 39.97,13.67 39.97,10.25 40.55,9.67 44.85,9.67 v46.09,10.91 | J1.S5 24.43,1.47 23.81,2.09 23.81,3.19 | v94.83,58.17 91.69,61.3 88.58,61.3 | R62.2 10.37,54.98 5.08,60.27 X26.1 | R64.2 29.25,49.73 28.46,48.93 9.72,48.93 v9.23,48.44 v9.21,48.44 | X8.1 1.53,10.33 0.76,9.57 0.76,6.2 1.64,5.32 3.76,5.32 8.76,5.32 11.36,2.73 19.25,2.73 19.28,2.75 | 74.23,44.77 75.37,44.77 76.25,43.88 76.25,40.25 v74.71,38.7 | R70.2 74.45,50.76 74.92,50.29 74.92,45.46 74.23,44.77
  Bottom 0.406: R64.2 30.47,51.83 R63.2 | R62.2
IO0  (via drill 0.25, 0.35)
  Top 0.203: S2.1 39.1,18.21 C7.1 38.38,18.93 v38.38,17.37 | U3.25 52.4,38.38 54.79,35.99 54.79,26.97 v56.92,24.84 v56.92,24.83
  Bottom 0.203: Q3.3 73.59,28.78 R4.1 66,29.14 62.42,25.55 57.64,25.55 v56.92,24.83 56.92,24.26 52.65,20 47.62,20 44.99,17.37 v38.38,17.37
M1  (via drill 0.25)
  Top 0.203: U3.29 49.29,33.3 v49.26,33.33 | v23.96,33.5 24.3,33.84 v24.3,37.34
  Bottom 0.203: v49.26,33.33 v49.25,33.32 47.54,33.32 46.07,31.84 32.52,31.84 30.84,33.52 23.98,33.52 v23.96,33.5 | v24.3,37.34 24.3,42.46 EBYTEE220-900T22D1.M1
N$1  (via drill 0.25)
  Top 0.203: v29.33,9.78 29.33,6.85 28.82,6.34 11.73,6.34 9.93,8.14 v9.93,11.06 | v48.23,31.7 47.7,32.24 47.7,34.04 48.23,34.57 U3.28
  Bottom 0.203: D5.C v29.33,9.77 v29.33,9.78 | v9.93,11.06 9.93,27.29 11.32,28.68 19.7,28.68 22.35,26.02 26.57,26.02 31.73,31.19 47.73,31.19 v48.23,31.7
N$2
  Top 0.203: C5.1 46.87,13.39 45.7,12.22 41.59,12.22 41.26,12.55 U1.4
N$3
  Bottom 0.203: R1.2 82.2,34.39 82.96,33.64 Q2.1
N$4
  Top 0.203: U1.7 37.45,15.59 36.67,16.38 36.67,24.45 37.41,25.2 44.51,25.2 45.26,25.94 Q1.2 45.26,32.22 C1.2
N$5
  Top 0.203: U1.8 36.23,14.46 36.23,27.13 Q1.1 35.61,29.28 36.29,29.96 C2.2
N$6
  Bottom 0.203: R2.2 78.27,36.81 75.42,33.96 Q3.1
N$7
  Bottom 1.27: X1.1 98.17,9.38 94.73,12.82 86.93,12.82 84.56,15.2 PS1.1
N$8
  Bottom 1.27: X1.2 103.25,10.34 97.01,16.57 PS1.2
N$10
  Bottom 0.203: D3.A 26.02,13.93 26.65,13.3 28.72,13.3 33.14,8.87 33.14,6.39 35.46,4.06 44.41,4.06 50.46,10.12 52.8,10.12 53.72,9.19 53.72,2 54.61,1.12 92.04,1.12 93.95,3.03 93.95,9.52 92.75,10.72 87.02,10.72 85.86,9.57 85.86,7.01 X2.1
N$12
  Bottom 0.203: D4.A 11.99,5.06 9.23,7.82 3.03,7.82 X8.2
N$17
  Top 0.203: Q5.B 21.81,62.01 22.29,61.53 22.29,60.39 22.73,59.96 R12.2
N$18
  Bottom 0.203: IC2.18 57.34,50.2 58.91,48.63 66.92,48.63 68.36,50.06 68.36,52.49 68.8,52.92 R65.1
N$19
  Top 0.203: Q5.E 7.37,62.03 5.8,63.6 5.8,73.41 7.02,74.64 12.73,74.64 13.25,75.17 X10.2
N$20  (via drill 0.25)
  Top 0.203: v19.24,37.59 19.01,37.36 v19.01,27.27
  Bottom 0.203: D7.C 13.07,26.69 14.01,27.63 18.64,27.63 v19.01,27.27 | v19.24,37.59 19.24,42.44 EBYTEE220-900T22D1.TXD
N$21
  Top 0.203: R14.2 29.52,59.86 29.05,60.34 29.05,61.4 Q6.B
N$22
  Bottom 0.203: R59.1 35.34,47.61 36.3,48.57 40.05,48.57 41.12,49.64 IC1.18
N$23
  Top 0.203: Q6.E 26.6,63.1 26.25,63.45 18.92,63.45 17.99,62.51 7.63,62.51 6.23,63.91 6.23,72.93 7.42,74.12 13.19,74.12 13.6,74.53 23.51,74.53 23.7,74.72 X11.2
N$24
  Top 0.203: R16.2 36.01,59.96 35.61,60.36 35.61,61.54 Q7.B
N$25
  Bottom 0.203: R62.1 33.82,54.99 35.8,53 IC1.15
N$26
  Top 0.203: Q7.E 33.24,62.83 32.84,63.24 27.63,63.24 26.99,63.88 18.58,63.88 17.67,62.97 7.93,62.97 6.66,64.24 6.66,72.47 7.84,73.64 13.96,73.64 14.38,74.06 33.7,74.06 34.18,74.54 34.18,76.89 X12.2
N$27
  Top 0.203: R18.2 42,59.95 41.59,60.36 41.59,61.57 Q8.B
N$28
  Bottom 0.203: R63.1 33.55,51.84 35.5,49.89 39.3,49.89 39.83,50.42 39.83,52.99 IC1.16
N$29
  Top 0.203: Q8.E 39.25,63.28 38.86,63.67 27.99,63.67 27.37,64.29 18.32,64.29 17.52,63.49 8.18,63.49 7.13,64.54 7.13,72.15 8.11,73.14 14.31,73.14 14.71,73.53 34.27,73.53 34.8,74.07 43.83,74.07 44.57,74.81 X13.2
N$30
  Top 0.203: R20.2 48.23,59.91 47.83,60.32 47.83,61.56 Q9.B
N$31
  Bottom 0.203: R64.1 33.55,49.73 34.33,48.95 39.56,48.95 40.48,49.87 40.48,52.99 IC1.17
N$32
  Top 0.203: Q9.E 45.5,63.11 44.55,64.06 28.25,64.06 27.61,64.7 18.1,64.7 17.4,64 8.67,64 7.62,65.05 7.62,71.65 8.61,72.65 14.61,72.65 14.97,73.01 34.55,73.01 35.1,73.57 44.17,73.57 44.69,74.08 54.59,74.08 55.02,74.52 X14.2
N$33
  Top 0.203: R22.2 54.9,59.92 54.83,59.99 54.83,61.55 Q10.B
N$34
  Bottom 0.203: R68.1 69.15,47.32 57.09,47.32 55.39,49.02 IC2.15
N$35
  Top 0.203: Q10.E 52.48,62.65 51.37,63.76 45.66,63.76 44.94,64.48 28.55,64.48 27.9,65.14 17.78,65.14 17.18,64.55 8.97,64.55 8.09,65.43 8.09,71.08 9.2,72.18 14.95,72.18 15.26,72.49 34.93,72.49 35.49,73.06 44.46,73.06 45,73.59 56.06,73.59 56.58,74.11 64.8,74.11 65.49,74.81 65.49,76.93 X15.2
N$36
  Top 0.203: R24.2 61.3,59.89 60.89,60.3 60.89,61.48 Q11.B
N$37
  Bottom 0.203: R69.1 69.84,48.45 68.11,48.45 67.42,47.77 57.55,47.77 56.02,49.3 56.02,52.8 IC2.16
N$38
  Top 0.203: Q11.E 58.49,63.38 57.69,64.18 46.06,64.18 45.3,64.94 28.8,64.94 28.18,65.56 17.56,65.56 17,65 9.48,65 8.63,65.85 8.63,70.89 9.45,71.7 15.24,71.7 15.59,72.05 35.28,72.05 35.82,72.6 44.83,72.6 45.33,73.11 56.34,73.11 56.87,73.64 65.4,73.64 65.81,74.05 75.36,74.05 75.94,74.64 X16.2
N$39
  Top 0.203: R26.2 66.81,59.75 66.43,60.13 66.43,61.39 Q12.B
N$40
  Bottom 0.203: R70.1 69.92,50.84 69.86,50.84 67.21,48.19 58.07,48.19 56.69,49.58 IC2.17
N$41
  Top 0.203: Q12.E 64.07,63.49 62.97,64.59 46.48,64.59 45.72,65.36 29.16,65.36 28.52,65.99 17.26,65.99 16.74,65.47 9.86,65.47 9.15,66.18 9.15,70.58 9.76,71.19 15.56,71.19 15.91,71.54 35.62,71.54 36.21,72.12 45.22,72.12 45.66,72.57 56.74,72.57 57.26,73.09 65.82,73.09 66.21,73.47 75.75,73.47 76.33,74.06 85.77,74.06 86.41,74.7 X17.2
N$42
  Top 0.203: R28.2 67.49,53.34 67.14,53.69 67.14,54.96 Q13.B
N$44  (via drill 0.25)
  Top 0.203: v70.28,57.81 69.14,56.67 65.01,56.67 64.78,56.44 Q13.E
  Bottom 0.203: v70.28,57.81 76.43,57.81 76.81,58.19 76.81,60.24 76.55,60.5 72.27,60.5 71.6,61.17 71.6,68.69 72.89,69.98 95.7,69.98 96.93,71.22 X18.2
N$45
  Top 0.203: R30.2 61.18,53.37 60.84,53.71 60.84,54.98 Q14.B
N$47  (via drill 0.25)
  Top 0.203: Q14.E 58.49,56.55 59.11,57.17 62.17,57.17 62.94,57.95 68.21,57.95 69.57,59.31 69.57,60.91 v69.58,60.91 | v66.34,71.32 61.33,71.32 60.3,70.29 v60.3,68.76
  Bottom 0.203: v69.58,60.91 69.58,61.79 70.42,62.64 70.42,64.66 69.83,65.25 67.46,65.25 66.78,65.93 66.78,70.88 v66.34,71.32 | v60.3,68.76 60.3,65.81 59.77,65.29 13.93,65.29 13.26,65.96 X19.2
N$48
  Top 0.203: R32.2 54.8,53.39 54.43,53.75 54.43,54.97 Q15.B
N$50
  Top 0.203: Q15.E 51.03,54.44 51.03,51.54 51.5,51.08 70.08,51.08 72.03,53.02 72.03,59 71.03,60 71.03,63.29 70.23,64.09 64.15,64.09 63.17,65.08 46.87,65.08 46.2,65.74 29.66,65.74 28.75,66.66 28.75,70.1 28.08,70.77 24.13,70.77 23.69,70.32 X20.2
N$51
  Top 0.203: R34.2 48.22,53.42 47.89,53.75 47.89,54.98 Q16.B
N$53
  Top 0.203: Q16.E 44.88,54.85 44.88,51.49 45.69,50.68 70.35,50.68 72.48,52.81 72.48,59.39 71.46,60.41 71.46,63.71 70.6,64.57 64.51,64.57 63.59,65.49 47.31,65.49 46.62,66.17 34.45,66.17 34.09,66.54 34.09,68.33 X21.2
N$54
  Top 0.203: R36.2 41.93,53.45 41.59,53.8 41.59,55.03 Q17.B
N$56
  Top 0.203: Q17.E 38.63,54.91 38.63,51.55 39.37,50.81 44.86,50.81 45.36,50.32 70.88,50.32 72.89,52.32 72.89,59.77 71.84,60.81 71.84,64.23 71.03,65.05 64.76,65.05 63.96,65.85 50.27,65.85 50,66.12 50,70.2 49.07,71.13 45.03,71.13 44.57,70.67 X22.2
N$57
  Top 0.203: R38.2 35.9,53.48 35.58,53.79 35.58,55.05 Q18.B
N$59
  Top 0.203: Q18.E 32.86,55.51 32.52,55.18 32.52,52.29 33.84,50.97 38.42,50.97 38.99,50.4 44.65,50.4 45.11,49.93 71.33,49.93 73.3,51.9 73.3,60.01 72.25,61.06 72.25,64.42 71.11,65.56 65.03,65.56 64.36,66.22 55.32,66.22 55.05,66.5 X23.2
N$60
  Top 0.203: R40.2 29.8,53.42 29.42,53.79 29.42,55.01 Q19.B
N$62
  Top 0.203: Q19.E 26.66,55.5 26.34,55.18 26.34,52.46 25.27,51.39 25.27,50.69 25.42,50.54 37.87,50.54 38.41,49.99 44.49,49.99 44.99,49.5 71.67,49.5 73.78,51.6 73.78,60.36 72.64,61.49 72.64,64.89 71.49,66.04 66.24,66.04 65.49,66.78 X24.2
N$63
  Top 0.203: R42.2 23.63,53.42 23.25,53.81 23.25,55.03 Q20.B
N$65
  Top 0.203: Q20.E 18.23,55.5 16.76,56.97 16.76,60.72 16.2,61.29 7.36,61.29 5.41,63.23 5.41,67.46 4.67,68.2 3.01,68.2 X25.2
N$66
  Top 0.203: R44.2 23.6,46.35 23.23,46.72 23.23,47.94 Q21.B
N$68
  Top 0.203: Q21.E 17.3,48.41 14.75,50.95 14.75,60.14 14.28,60.61 8.34,60.61 5.53,57.79 3.05,57.79 X26.2
N$69
  Top 0.203: R46.2 29.72,46.32 29.37,46.67 29.37,47.91 Q22.B
N$71
  Top 0.203: Q22.E 26.46,47.84 26.46,45.09 26.05,44.69 7.59,44.69 5.03,47.24 3,47.24 X27.2
N$72
  Top 0.203: R48.2 35.96,46.29 35.63,46.62 35.63,47.87 Q23.B
N$74
  Top 0.203: Q23.E 32.65,47.75 32.65,45.53 26.43,39.31 8.44,39.31 5.75,36.62 3.12,36.62 X28.2
N$75
  Top 0.203: R50.2 42.02,46.25 41.6,46.66 41.6,47.86 Q24.B
N$77
  Top 0.203: Q24.E 38.65,47.75 38.65,45.21 38.38,44.93 35.09,44.93 28.56,38.4 8.73,38.4 5.83,35.51 5.83,26.84 5.25,26.26 X29.2
N$78
  Top 0.203: R52.2 48.21,46.27 47.87,46.61 47.87,47.98 Q25.B
N$80  (via drill 0.25)
  Top 0.203: Q25.E 45.1,47.84 45.1,44.11 45.85,43.36 50.11,43.36 52.07,41.4 77.22,41.4 88.86,53.05 104.25,53.05 v105.28,52.01
  Bottom 0.203: v105.28,52.01 106.08,52.81 106.08,63.76 106.77,64.45 109.94,64.45 X30.2
N$81
  Top 0.203: R54.2 54.85,46.26 54.45,46.66 54.45,47.87 Q26.B
N$83
  Top 0.203: Q26.E 51.57,47.81 51.57,43.49 52.9,42.16 75.57,42.16 87.37,53.96 X31.2
N$84
  Top 0.203: R56.2 61.22,46.22 60.83,46.61 60.83,47.87 Q27.B
N$86
  Top 0.203: Q27.E 57.94,47.8 57.94,43.82 58.82,42.94 73.78,42.94 85.95,55.11 104.45,55.11 107.56,58.22 111.67,58.22 112.29,57.6 112.29,43.83 111.9,43.44 110.03,43.44 X32.2
N$87
  Top 0.203: R58.2 67.54,46.25 67.17,46.61 67.17,47.84 Q28.B
N$89  (via drill 0.25)
  Top 0.203: Q28.E 64.8,48.14 64.34,47.68 64.34,45.15 64.89,44.6 71.17,44.6 82.86,56.28 v100.61,56.28
  Bottom 0.203: v100.61,56.28 100.64,56.28 103.99,52.94 103.99,40.42 106.16,38.24 111.15,38.24 112.26,37.14 112.26,33.48 111.68,32.91 110.1,32.91 X33.2
O1  (via drill 0.25)
  Top 0.203: Q5.C 20.86,59.38 22.36,57.88 v24.65,57.88
  Bottom 0.203: R11.2 | R11.2 34.04,55.8 35.52,54.32 42.75,54.32 43.06,54.01 IC1.21 | R11.2 33.98,58.44 25.21,58.44 v24.65,57.88
O2  (via drill 0.25)
  Top 0.203: Q6.C 27.55,58.88 28.01,58.42 28.01,57.7 28.32,57.39 36.1,57.39 v36.15,57.33
  Bottom 0.203: R13.2 v36.15,57.33 36.15,55.34 36.79,54.7 43.34,54.7 43.72,54.32 IC1.22
O3  (via drill 0.25)
  Top 0.203: Q7.C 34.19,58.66 34.36,58.48 37.68,58.48 38.26,57.9 38.26,57.5 38.1,57.34 v38.24,57.34
  Bottom 0.203: R15.2 v38.24,57.34 38.24,55.86 39,55.1 43.95,55.1 44.36,54.69 IC1.23
O4  (via drill 0.25)
  Top 0.203: Q8.C 40.34,59.66 40.34,57.47 v40.34,57.36 v40.34,57.35
  Bottom 0.203: R17.2 40.34,58.47 v40.34,57.35 40.34,56 40.86,55.47 44.15,55.47 45.01,54.61 IC1.24
O5  (via drill 0.25)
  Top 0.203: Q9.C 46.45,58.77 46.35,58.68 42.7,58.68 42.42,58.4 42.42,57.37 v42.44,57.36
  Bottom 0.203: R19.2 v42.45,57.37 v42.44,57.36 42.44,56.29 42.77,55.96 45.13,55.96 45.66,55.42 IC1.25
O6  (via drill 0.25)
  Top 0.203: Q10.C 53.43,59.52 52.75,58.84 47.44,58.84 46.84,58.25 44.84,58.25 44.53,57.94 v44.53,57.32 | v44.53,57.32
  Bottom 0.203: R21.2 v44.53,57.32 v44.55,57.32 44.55,56.75 44.88,56.42 45.9,56.42 46.32,56.01 IC1.26
O7  (via drill 0.25)
  Top 0.203: Q11.C 59.44,58.98 59.13,58.67 53.48,58.67 53.27,58.46 47.63,58.46 46.51,57.34 v46.63,57.34
  Bottom 0.203: R23.2 v46.63,57.34 46.63,56.46 46.96,56.13 IC1.27
O8  (via drill 0.25)
  Top 0.203: v48.72,57.32 48.72,57.39 49.36,58.03 53.65,58.03 53.9,58.28 59.48,58.28 59.87,58.67 64.68,58.67 65.02,59.01 Q12.C
  Bottom 0.203: R25.2 v48.72,57.32 48.72,57.17 47.61,56.06 IC1.28
O9  (via drill 0.25)
  Top 0.203: Q13.C 65.73,51.89 65.45,51.61 54.69,51.61 v54.49,51.82
  Bottom 0.203: R27.2 51.43,40.93 50.69,41.67 48.76,41.67 47.61,42.82 IC1.1 47.61,47.3 48.06,47.75 50.42,47.75 v54.49,51.82
O10  (via drill 0.25)
  Top 0.203: Q14.C 59.44,52.54 59.18,52.28 55.14,52.28 54.73,52.69 54.31,52.69 53.46,51.85 v52.96,51.85
  Bottom 0.203: R29.2 49.29,40.41 46.96,42.75 IC1.2 46.96,47.7 47.45,48.19 49.96,48.19 52.96,51.2 v52.96,51.85
O11  (via drill 0.25)
  Top 0.203: Q15.C v51.82,52.08
  Bottom 0.203: R31.2 47.13,41.62 46.31,42.44 IC1.3 46.31,48.16 46.9,48.75 49.7,48.75 51.82,50.88 v51.82,52.08
O12  (via drill 0.25)
  Top 0.203: Q16.C 46.45,51.69 46.8,51.33 49.44,51.33 v49.73,51.63
  Bottom 0.203: R33.2 44.93,41.53 45.68,42.28 45.68,45.28 | 45.68,45.28 45.68,45.74 IC1.4 | v49.73,51.63 49.73,49.89 49.17,49.34 46.35,49.34 45.66,48.64 45.66,45.3 45.68,45.28
O13  (via drill 0.25)
  Top 0.203: Q17.C 40.17,51.82 40.49,51.5 v42.36,51.5
  Bottom 0.203: R35.2 42.81,40.45 45.01,42.66 IC1.5 45.02,50.43 43.94,51.5 v42.36,51.5
O14  (via drill 0.25)
  Top 0.203: Q18.C 34.18,52.31 34.64,51.85 35.56,51.85 v35.57,51.86 | v42.67,41.74 42.67,42.92 42.18,43.41 35.36,43.41 29.87,37.92 29.87,36.05 26.24,32.42 v25.17,32.42
  Bottom 0.203: R37.2 40.69,41.47 40.97,41.75 v42.67,41.75 v42.67,41.74 43.15,41.74 44.37,42.96 44.37,45.74 IC1.6 | v35.57,51.86 34.04,53.39 28.4,53.39 27.77,52.76 27.77,50.22 27.41,49.86 8.96,49.86 7.9,48.81 7.9,36.34 12.93,31.32 24.07,31.32 v25.17,32.42
O15  (via drill 0.25)
  Top 0.203: Q19.C 27.98,51.83 27.52,51.36 v26.78,51.36 | v26.39,31.19 26.98,31.19 30.52,34.72 30.52,37.55 34.99,42.03 36.49,42.03 v36.5,42.04
  Bottom 0.203: R39.2 38.56,41.73 | 38.56,41.73 38.56,41.93 39.11,42.47 42.91,42.47 43.72,43.28 IC1.7 | v26.39,31.19 25.78,30.58 12.6,30.58 7.35,35.83 7.35,49.92 8.8,51.36 v26.78,51.36 | v36.5,42.04 38.25,42.04 38.56,41.73
O16  (via drill 0.25)
  Top 0.203: Q20.C 21.69,53.16 19.76,53.16 v19.75,53.17 | v27.79,29.96 27.79,30.12 31.2,33.52 31.2,36.77 34.3,39.87 v34.55,39.87
  Bottom 0.203: IC1.8 43.06,43.38 42.59,42.91 36.17,42.91 35.03,41.76 35.03,40.35 | v19.75,53.17 8.14,53.17 6.78,51.82 6.78,35.44 12.3,29.92 27.76,29.92 v27.79,29.96 | R41.2 35.03,40.35 | 35.03,40.35 v34.55,39.87
O17  (via drill 0.35)
  Top 0.152: Q21.C 18.93,46.2 v18.77,46.05
  Bottom 0.152: v18.77,46.05 18.24,46.58 11.75,46.58 10.16,44.99 10.16,39.36 13.62,35.9 32.26,35.9 | 46.59,35.7 72.8,35.7 77.22,40.12 77.22,53.2 76.17,54.25 68.78,54.25 67.94,53.41 67.94,50.27 66.66,48.99 60.59,48.99 59.29,50.3 IC2.21
  Bottom 0.203: R43.2 52.63,54.91 53.13,54.41 59.01,54.41 59.3,54.11 59.3,52.83 IC2.21 | 32.26,35.9 34.53,33.63 44.52,33.63 46.59,35.7
O18  (via drill 0.35)
  Top 0.203: Q22.C 27.95,45.47 v27.23,44.76
  Bottom 0.203: R45.2 54.77,55.36 55.23,54.89 59.24,54.89 59.94,54.18 IC2.22 | IC2.22 | v27.23,44.76 27.23,46.22 26.35,47.1 11.35,47.1 9.65,45.41 9.65,39.02 13.22,35.45 31.89,35.45 34.21,33.13 44.72,33.13 46.87,35.28 72.9,35.28 77.82,40.2 77.82,53.68 76.86,54.64 68.47,54.64 67.46,53.63 67.46,50.41 66.43,49.38 61.31,49.38 59.94,50.75 IC2.22
O19  (via drill 0.35)
  Top 0.203: Q23.C 34.2,45.66 28.36,39.82 v28.36,39.62
  Bottom 0.203: R47.2 56.9,55.84 57.4,55.34 59.91,55.34 60.61,54.64 60.61,52.83 | 60.61,52.83 IC2.23 | 60.61,52.83 60.61,51.1 61.96,49.75 66.07,49.75 67,50.69 67,53.82 68.22,55.04 77.24,55.04 78.39,53.89 78.39,40.13 73.06,34.8 47.18,34.8 45.1,32.72 33.73,32.72 31.44,35 12.98,35 9.11,38.88 9.11,45.7 11.14,47.74 26.62,47.74 28.17,46.19 28.17,39.8 v28.36,39.62
O20  (via drill 0.35)
  Top 0.203: Q24.C 40.18,45.04 39.29,44.16 35.41,44.16 v28.37,37.11
  Bottom 0.203: R49.2 59.03,56.13 59.4,55.76 60.48,55.76 61.24,55.01 IC2.24 61.24,51.26 62.35,50.15 65.79,50.15 66.51,50.88 66.51,54.05 67.92,55.47 77.63,55.47 78.85,54.24 78.85,39.99 73.19,34.33 47.45,34.33 45.41,32.28 33.29,32.28 31.05,34.52 12.63,34.52 8.61,38.54 8.61,46.01 10.83,48.24 26.94,48.24 28.58,46.6 28.58,40.81 29.33,40.05 29.33,39.22 28.37,38.27 v28.37,37.11
O21  (via drill 0.25)
  Top 0.203: Q25.C 46.55,44.54 47.16,43.94 50.22,43.94 52.37,41.78 76.39,41.78 v79.77,45.17 v79.78,45.16
  Bottom 0.203: R51.2 61.14,56.2 61.89,55.46 61.89,53.09 | 61.89,53.09 IC2.25 | v79.78,45.16 79.78,54.37 78.23,55.91 67.61,55.91 66.06,54.36 66.06,51.12 65.59,50.65 62.63,50.65 61.86,51.42 61.86,53.07 61.89,53.09
O22  (via drill 0.25)
  Top 0.203: Q26.C 52.48,45.58 52.48,43.55 53.47,42.56 74.78,42.56 v80.98,48.76
  Bottom 0.203: R53.2 63.25,56.22 62.54,55.5 IC2.26 62.54,51.5 62.94,51.1 65.23,51.1 65.58,51.45 65.58,54.7 67.3,56.42 78.7,56.42 80.98,54.14 v80.98,48.76
O23  (via drill 0.25)
  Top 0.203: Q27.C 59.42,44.5 60.52,43.39 72.41,43.39 v82.11,53.09
  Bottom 0.203: R55.2 65.38,57.48 63.19,55.28 IC2.27 63.19,51.68 63.35,51.51 64.73,51.51 65.15,51.94 65.15,55.09 66.97,56.91 79.1,56.91 82.11,53.89 v82.11,53.09
O24  (via drill 0.25)
  Top 0.203: Q28.C 65.75,45.33 66.09,45 70.93,45 81.88,55.94 81.88,57.7 80.54,59.04 v75.82,59.04 v75.81,59.04
  Bottom 0.203: R57.2 67.49,58.46 | 67.49,58.46 67.49,58.32 66.33,57.17 65.94,57.17 63.84,55.06 IC2.28 | v75.81,59.04 69.43,59.04 68.84,58.46 67.5,58.46 67.49,58.46
ROTATY-CCW
  Top 0.203: X5.2 111.49,19.96 112.2,20.67 112.2,26.8 111.58,27.42 107.1,27.42 106.34,28.17 106.34,40.27 105.62,41.01 55.48,41.01 55.26,40.78 55.26,39.4 U3.23
  Bottom 0.203: R6.1 106.54,21.3 107.88,19.96 X5.2
ROTATY-CW
  Top 0.203: X5.3 106.47,22.5 105.76,23.21 105.76,39.62 104.84,40.53 71.76,40.53 70.13,38.91 70.13,37.56 69.59,37.02 68.32,37.02 U3.13
  Bottom 0.203: X5.3 108.22,22.5 106.83,23.89 R5.1
RTS  (via drill 0.25)
  Top 0.203: U1.14 42.53,10.53 v42.92,10.92
  Bottom 0.203: R2.1 84.02,36.81 84.86,35.98 Q2.2 85.88,31.05 86.36,30.56 86.36,27.44 85.17,26.25 79.5,26.25 78.97,25.72 70.53,25.72 67.09,22.28 57.93,22.28 52.26,16.61 47.56,16.61 46.94,15.99 43.42,15.99 42.92,15.49 v42.92,10.92
RX
  Top 0.203: U1.3 42.53,16.12 43.07,16.65 53.97,16.65 55.77,18.45 55.77,23.48 53.57,25.68 U3.35
RX_LORA  (via drill 0.25)
  Top 0.203: v26.13,3.14 12.04,3.14 8.56,6.62 v8.56,12.45 | v21.77,37.19 23.27,35.7 v23.27,27.63
  Bottom 0.203: D5.A 26.91,3.7 26.46,4.14 | 26.46,4.14 R7.1 | 26.46,4.14 26.46,3.47 v26.13,3.14 | v8.56,12.45 8.56,28.09 9.81,29.34 21.56,29.34 v23.27,27.63 | v21.77,37.19 21.77,42.45 EBYTEE220-900T22D1.RXD
RX_RS485  (via drill 0.25)
  Top 0.203: v53.45,30.31 53,30.76 U3.31
  Bottom 0.203: TTL-RS1.RX 80.23,57.96 83.75,54.44 83.75,43.61 73.46,33.32 56.39,33.32 53.42,30.34 v53.45,30.31
SCL  (via drill 0.25)
  Top 0.203: U3.36 53.11,24.41 53.14,24.39 v53.16,24.39 | v70.96,30.75 71.43,30.75 72,31.32 72,34.62 72.68,35.3 v72.68,36.92
  Bottom 0.203: IC1.12 40.49,45.78 40.49,47.27 40.05,47.7 37.52,47.7 34.93,45.11 R60.1 32.37,44.02 32.11,43.77 29.38,43.77 29.03,43.43 29.03,41.1 29.95,40.19 29.95,37 30.48,36.46 32.51,36.46 34.79,34.19 44.35,34.19 46.31,36.15 71.96,36.15 72.68,36.87 v72.68,36.92 73.69,37.93 73.69,39.05 75.27,40.63 75.27,43.49 74.5,44.27 70.38,44.27 69.95,43.84 69.95,42.95 R66.1 69.14,41.94 56.13,41.94 55.86,42.21 55.86,43.58 56.69,44.41 IC2.12 | v53.16,24.39 54.56,25.79 54.56,28.99 57.73,32.17 68.5,32.17 69.92,30.75 v70.96,30.75
SDA  (via drill 0.25)
  Top 0.203: U3.33 53.17,28.22 v53.19,28.24 | v70.83,32.35 70.83,35.83 71.23,36.23 v71.23,38.43
  Bottom 0.203: IC1.13 39.81,46.92 39.53,47.2 37.84,47.2 33.03,42.39 R61.2 32.44,38 34.2,36.24 45.02,36.24 45.44,36.66 69.43,36.66 71.2,38.43 v71.23,38.43 71.19,38.43 70.08,39.55 R67.2 | R67.2 | R67.2 68.99,40.64 68.14,41.5 55.74,41.5 55.33,41.9 55.33,43.77 56.04,44.47 IC2.13 | v53.19,28.24 53.19,28.55 57.36,32.71 70.47,32.71 v70.83,32.35
TX
  Top 0.203: U1.2 43.8,15.79 44.15,16.14 54.33,16.14 56.27,18.08 56.27,23.91 53.23,26.95 U3.34
TX_LORA  (via drill 0.25)
  Top 0.203: v48.15,29.96 46.92,31.19 46.92,35.14 47.62,35.84 U3.27
  Bottom 0.203: D7.A 14.72,15.42 | 14.72,15.42 15.92,15.42 16.33,15.84 R8.1 | 14.72,15.42 14.72,24.49 15.59,25.36 26.94,25.36 31.5,29.92 48.11,29.92 v48.15,29.96
TX_RS485  (via drill 0.25)
  Top 0.203: v53.21,32.03 U3.30
  Bottom 0.203: TTL-RS1.TX 77.7,62.18 77.7,59.55 83.14,54.1 83.14,43.68 73.35,33.88 55,33.88 53.18,32.06 v53.21,32.03
USB_N
  Top 0.203: J1.2 40.41,6.13 39.86,6.67 33.95,6.67 33.11,7.51 33.11,10.85 | 33.11,10.85 | 33.11,10.85 33.11,11 33.68,11.57 | 33.68,11.57 | 33.68,11.57 33.89,11.78 38.38,11.78 38.72,12.13 U1.6
USB_P
  Top 0.203: J1.3 41.06,6.23 40.23,7.05 34.07,7.05 33.46,7.66 33.46,10.85 34.04,11.43 38.52,11.43 39.99,12.9 U1.5
VCC  (via drill 0.25)
  Top 0.203: U2.2 39.82,38.1 | 39.82,38.1 U2.4 | v74.3,32.65 78.94,32.65 79.22,32.37 v79.23,32.37 79.24,32.38 81.61,32.38 82.26,31.74 82.26,27.4 81.3,26.44 72.1,26.44 70.75,25.1 70.75,24.6 | v29.14,23.75 29.14,28.24 32.7,31.8 32.7,35.88 33.74,36.93 35.56,36.93 37.02,38.4 39.52,38.4 39.82,38.1 | U3.2 69.29,23.14 70.75,24.6 | v70.75,24.33 70.75,24.6 | v26.43,8.55 26.43,7.47 26.06,7.09 13.24,7.09 11.71,8.62 11.71,10.94 v11.7,10.94
  Bottom 0.203: 18.54,18.57 19.64,18.57 C9.2 19.72,22.89 20.58,23.75 v29.14,23.75 29.14,18.48 31.25,16.37 35.88,16.37 39.07,13.19 39.07,9.49 39.62,8.94 45.98,8.94 49.56,12.52 69.11,12.52 70.63,14.04 70.63,24.33 v70.75,24.33 | 18.54,18.57 R8.2 | R4.2 73.23,32.18 73.7,32.65 v74.3,32.65 | v79.23,32.37 79.88,32.37 80.69,31.57 R3.2 | R7.2 26.43,6.98 v26.43,8.55 | v11.7,10.94 11.7,12.06 12.39,12.76 17.07,12.76 18.14,13.83 18.14,18.17 18.54,18.57
VUSB  (via drill 0.25)
  Top 0.203: J1.1 39.76,5.77 39.37,6.16 33.58,6.16 32.18,7.55 32.18,10.85 | 32.18,10.85 v34.34,13.01 34.34,18.27 C3.+ | U1.16 45.07,6.42 v44.62,5.97 | v23.77,9.53 23.77,10.44 24.13,10.8 32.13,10.8 32.18,10.85
  Bottom 0.203: C4.1 22.59,8.11 22.28,7.8 22.28,5.64 21.73,5.08 D8.A | v44.62,5.97 43.82,5.17 35.48,5.17 34.32,6.33 34.32,13.05 34.34,13.03 v34.34,13.01 | C4.1 23.81,9.53 | C4.1 23.81,9.48 v23.77,9.53
(copper drawn outside any net)
  shapes: Top area x2